# Altium project Mirny.PrjPCB (part 2 of 4)

## Sheet VCO_channel.SchDoc: ADF4351 VCO
size 420 x 297 mm; Author: K.B.; CompanyName: WUT; DrawnBy: K.B.; Organization: WUT ISE; Address1: Warsaw Univeristy of Technology; Address2: Nowowiejska 15/19; DocumentNumber: 3; Revision: 1.1.4; SheetNumber: 2; SheetTotal: 10; EDA_Number: ARTIQ; Projet: ARTIQ/SINARA; ModifiedBy: -; CreateDate: XX/XX/XXXX; CheckedDate: -; Title2: Channel; DivGrp: ISE; Designer: K.B.; ModifiedDate: -; ProjectName: ARTIQ/SINARA
Used 4 times, as channels U_VCO_channel0, U_VCO_channel1, U_VCO_channel2, U_VCO_channel3. Parts and nets are listed once, with the designators drawn on the sheet.
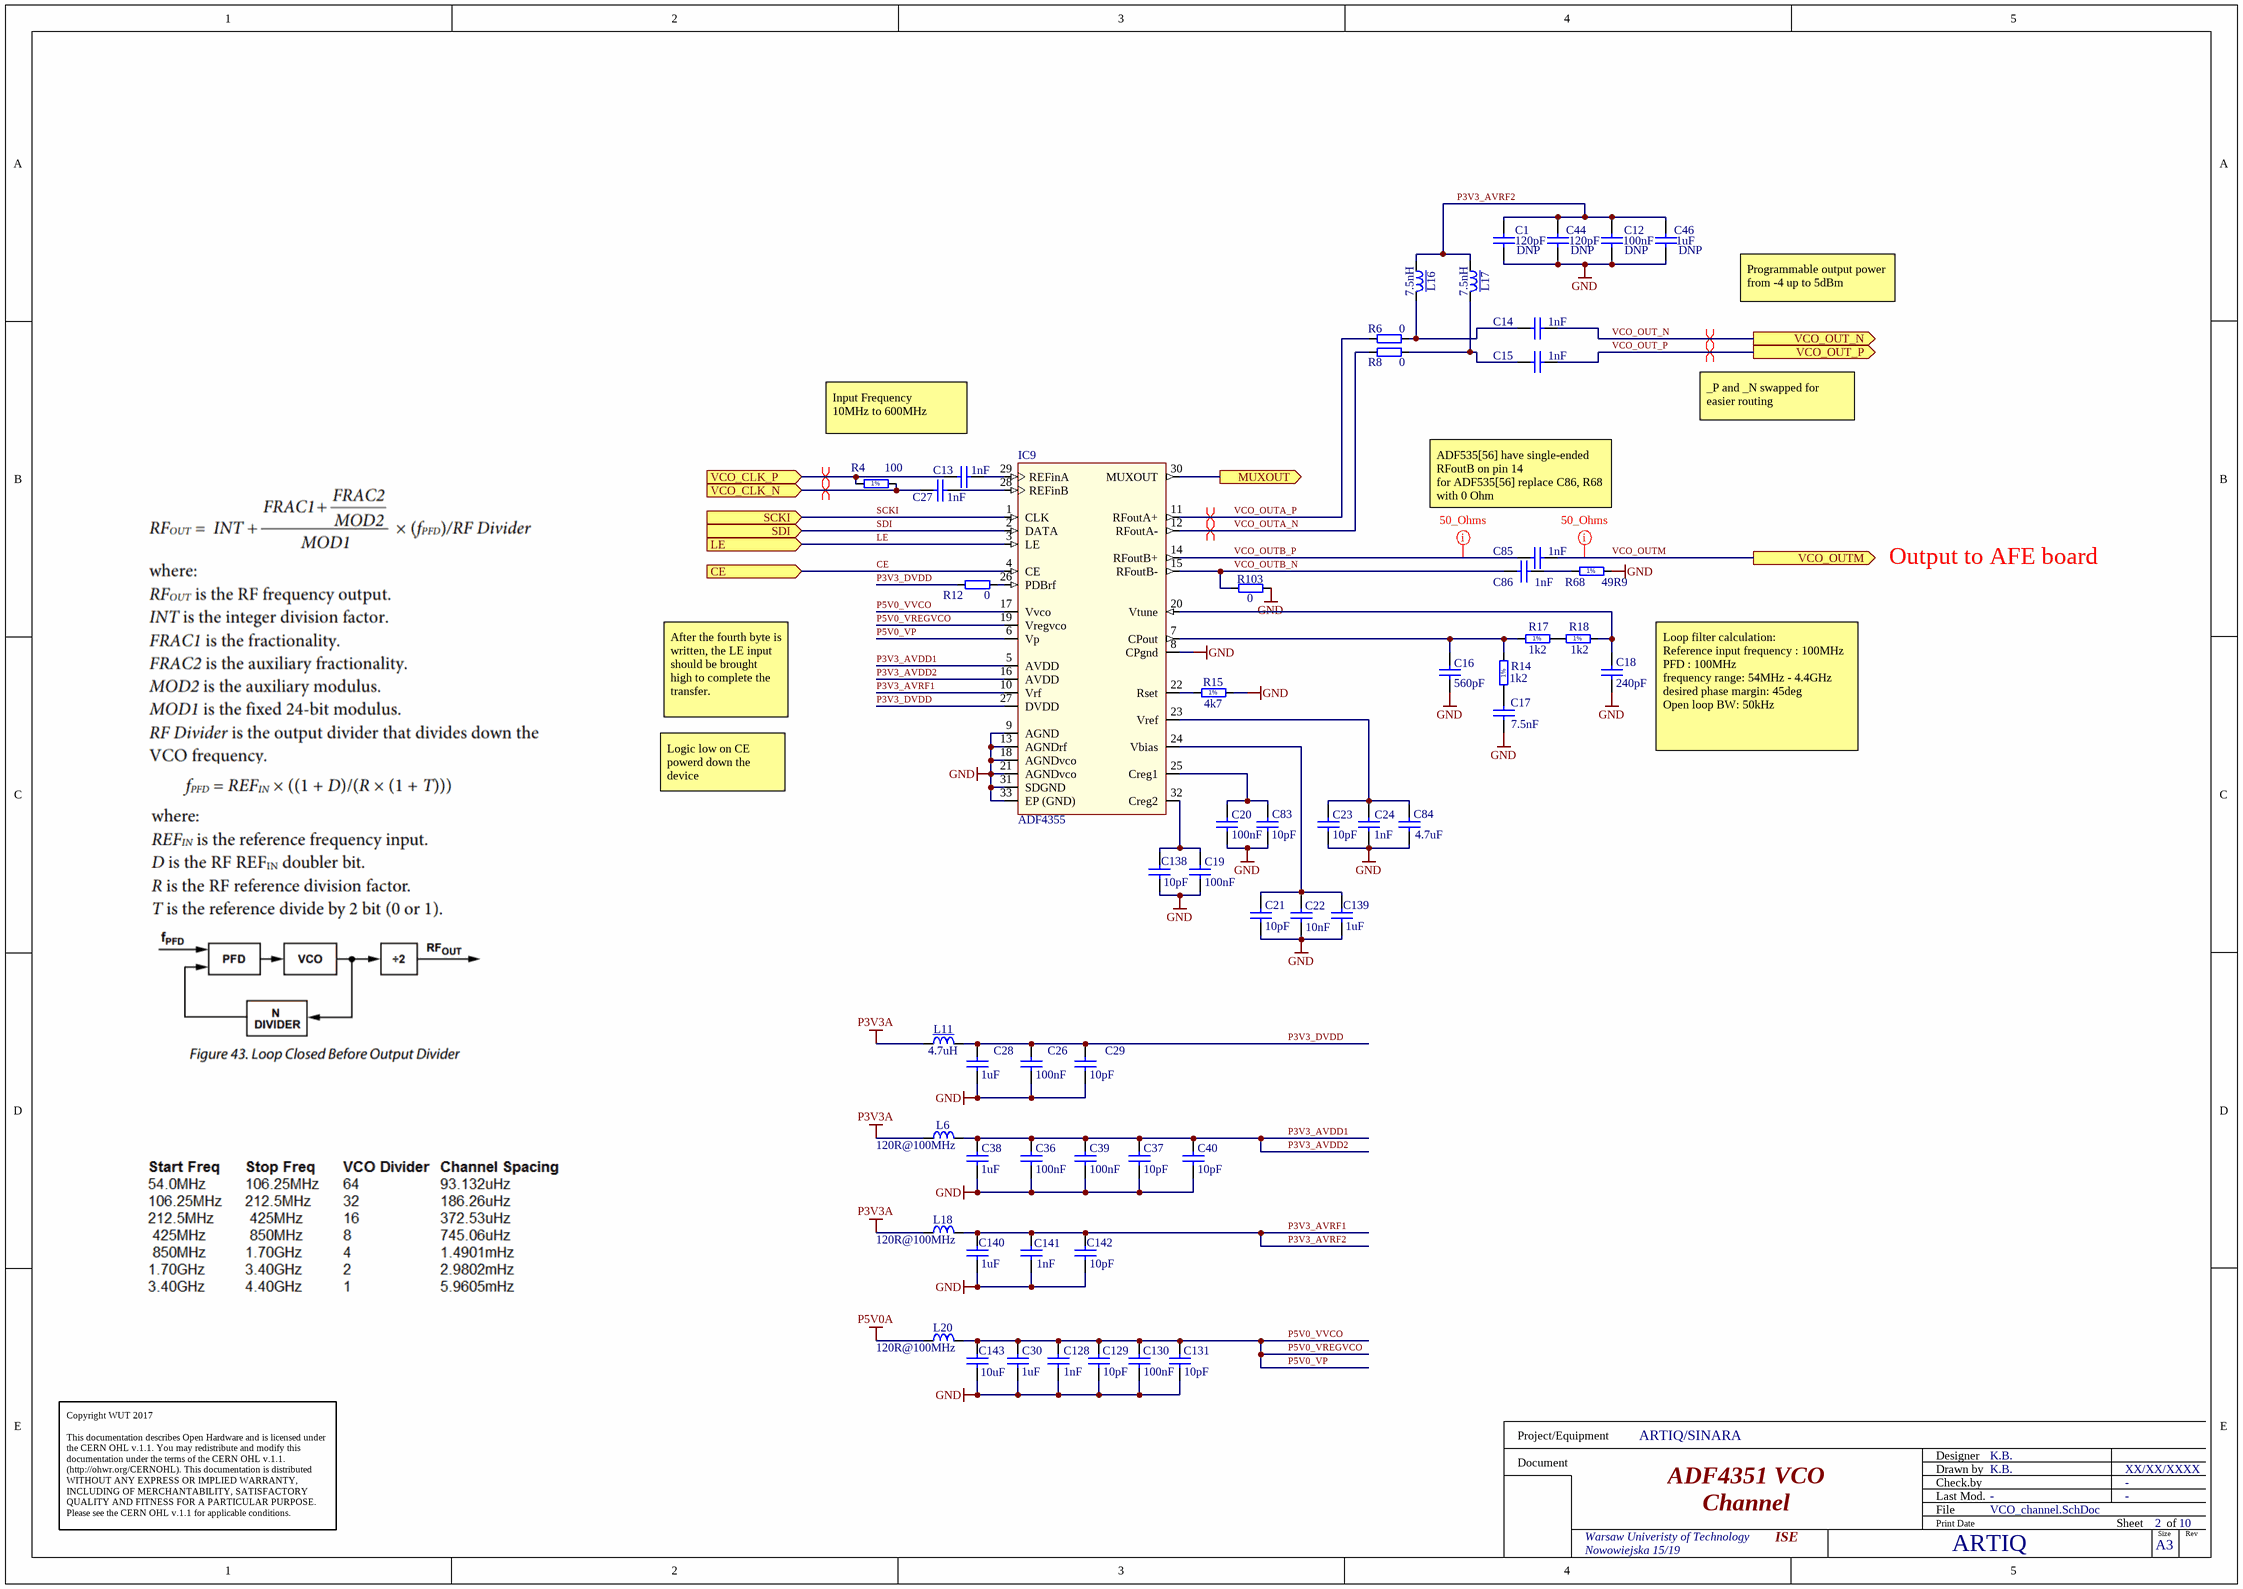
[diagram p3: VCO_channel.SchDoc]

### Parts
C1  120pF  Mounted: DNP  [CAPC1005X55N]
C12  100nF  Mounted: DNP  [CAPC1005X55N]
C13  1nF  [CAPC1005X55N]
C14  1nF  [CAPC1005X55N]
C15  1nF  [CAPC1005X55N]
C16  560pF  [CAPC1005X55N]
C17  7.5nF  [CAPC1005X55N]
C18  240pF  [CAPC1005X55N]
C19  100nF  [CAPC1005X55N]
C20  100nF  [CAPC1005X55N]
C21  10pF  [CAPC1005X55N]
C22  10nF  [CAPC1005X55N]
C23  10pF  [CAPC1005X55N]
C24  1nF  [CAPC1005X55N]
C26  100nF  [CAPC1005X55N]
C27  1nF  [CAPC1005X55N]
C28  1uF  [CAPC1005X55N]
C29  10pF  [CAPC1005X55N]
C30  1uF  [CAPC1005X55N]
C36  100nF  [CAPC1005X55N]
C37  10pF  [CAPC1005X55N]
C38  1uF  [CAPC1005X55N]
C39  100nF  [CAPC1005X55N]
C40  10pF  [CAPC1005X55N]
C44  120pF  Mounted: DNP  [CAPC1005X55N]
C46  1uF  Mounted: DNP  [CAPC1005X55N]
C83  10pF  [CAPC1005X55N]
C84  4.7uF  [CAPC1608X80N]
C85  1nF  [CAPC1005X55N]
C86  1nF  [CAPC1005X55N]
C128  1nF  [CAPC1005X55N]
C129  10pF  [CAPC1005X55N]
C130  100nF  [CAPC1005X55N]
C131  10pF  [CAPC1005X55N]
C138  10pF  [CAPC1005X55N]
C139  1uF  [CAPC1005X55N]
C140  1uF  [CAPC1005X55N]
C141  1nF  [CAPC1005X55N]
C142  10pF  [CAPC1005X55N]
C143  10uF  [CAPC1608X80N]
IC9  ADF4355  [CP-32-7_N]
L6  120R@100MHz  [INDC1608X95N]
L11  4.7uH  [INDC2012X145N]
L16  7.5nH  [IND_COILCRAFT_0402DC]
L17  7.5nH  [IND_COILCRAFT_0402DC]
L18  120R@100MHz  [INDC1608X95N]
L20  120R@100MHz  [INDC1608X95N]
R4  100  [RESC1005X40N]
R6  0  [RESC1005X40N]
R8  0  [RESC1005X40N]
R12  0  [RESC1005X40N]
R14  1k2  [RESC1005X40N]
R15  4k7  [RESC1005X40N]
R17  1k2  [RESC1005X40N]
R18  1k2  [RESC1005X40N]
R68  49R9  [RESC1005X40N]
R103  0  [RESC1005X40N]

### Ports
CE (in), LE (in), MUXOUT (out), SCKI (in), SDI (in), VCO_CLK_N (in), VCO_CLK_P (in), VCO_OUT_N (out), VCO_OUT_P (out), VCO_OUTM (out)

### Nets
GND: C1.1 C12.1 C16.1 C17.1 C18.1 C19.1 C20.1 C21.1 C22.1 C23.1 C24.1 C26.1 C28.1 C29.1 C30.1 C36.1 C37.1 C38.1 C39.1 C40.1 C44.1 C46.1 C83.1 C84.1 C128.1 C129.1 C130.1 C131.1 C138.1 C139.1 C140.1 C141.1 C142.1 C143.1 IC9.8(CPgnd) IC9.9(AGND) IC9.13(AGNDrf) IC9.18(AGNDvco) IC9.21(AGNDvco) IC9.31(SDGND) IC9.33(EP_(GND)) R15.2 R68.2 R103.2
P3V3A: L6.2 L11.1 L18.2
P5V0A: L20.2
CE: IC9.4(CE) ; port CE
LE: IC9.3(LE) ; port LE
MUXOUT: IC9.30(MUXOUT) ; port MUXOUT
P3V3_AVDD1: C36.2 C37.2 C38.2 C39.2 C40.2 IC9.5(AVDD) IC9.16(AVDD) L6.1  [also labelled P3V3_AVDD2]
P3V3_AVRF1: C1.2 C12.2 C44.2 C46.2 C140.2 C141.2 C142.2 IC9.10(Vrf) L16.1 L17.1 L18.1  [also labelled P3V3_AVRF2]
P3V3_DVDD: C26.2 C28.2 C29.2 IC9.27(DVDD) L11.2 R12.1
P5V0_VP: C30.2 C128.2 C129.2 C130.2 C131.2 C143.2 IC9.6(Vp) IC9.17(Vvco) IC9.19(Vregvco) L20.1  [also labelled P5V0_VREGVCO, P5V0_VVCO]
SCKI: IC9.1(CLK) ; port SCKI
SDI: IC9.2(DATA) ; port SDI
VCO_CLK_N: C27.1 R4.2 ; port VCO_CLK_N
VCO_CLK_P: C13.1 R4.1 ; port VCO_CLK_P
VCO_OUT_N: C14.2 ; port VCO_OUT_N
VCO_OUT_P: C15.2 ; port VCO_OUT_P
VCO_OUTA_N: IC9.12(RFoutA-) R8.1
VCO_OUTA_P: IC9.11(RFoutA+) R6.1
VCO_OUTB_N: C86.1 IC9.15(RFoutB-) R103.1
VCO_OUTB_P: C85.1 IC9.14(RFoutB+)
VCO_OUTM: C85.2 ; port VCO_OUTM
NetC13_2: C13.2 IC9.29(REFinA)
NetC14_1: C14.1 L16.2 R6.2
NetC15_1: C15.1 L17.2 R8.2
NetC16_2: C16.2 IC9.7(CPout) R14.2 R17.1
NetC17_2: C17.2 R14.1
NetC18_2: C18.2 IC9.20(Vtune) R18.2
NetC19_2: C19.2 C138.2 IC9.32(Creg2)
NetC20_2: C20.2 C83.2 IC9.25(Creg1)
NetC21_2: C21.2 C22.2 C139.2 IC9.24(Vbias)
NetC23_2: C23.2 C24.2 C84.2 IC9.23(Vref)
NetC27_2: C27.2 IC9.28(REFinB)
NetC86_2: C86.2 R68.1
NetIC9_22: IC9.22(Rset) R15.1
NetIC9_26: IC9.26(PDBrf) R12.2
NetR17_2: R17.2 R18.1

### Channels
U_VCO_channel0: designators end in A; ports CE=CE_U_VCO_channel0 LE=LE_U_VCO_channel0 MUXOUT=VCO_MUXOUT0 SCKI=SCKI_U_VCO_channel0 SDI=SDI_U_VCO_channel0 VCO_CLK_N=VCO_CLK0_N VCO_CLK_P=VCO_CLK0_P VCO_OUT_N=VCO_OUT_N VCO_OUT_P=VCO_OUT_P VCO_OUTM=VCO_OUTM
U_VCO_channel1: designators end in B; ports CE=CE_U_VCO_channel1 LE=LE_U_VCO_channel1 MUXOUT=VCO_MUXOUT1 SCKI=SCKI_U_VCO_channel1 SDI=SDI_U_VCO_channel1 VCO_CLK_N=VCO_CLK1_N VCO_CLK_P=VCO_CLK1_P VCO_OUT_N=VCO_OUT_N VCO_OUT_P=VCO_OUT_P VCO_OUTM=VCO_OUTM
U_VCO_channel2: designators end in C; ports CE=CE_U_VCO_channel2 LE=LE_U_VCO_channel2 MUXOUT=VCO_MUXOUT2 SCKI=SCKI_U_VCO_channel2 SDI=SDI_U_VCO_channel2 VCO_CLK_N=VCO_CLK2_N VCO_CLK_P=VCO_CLK2_P VCO_OUT_N=VCO_OUT_N VCO_OUT_P=VCO_OUT_P VCO_OUTM=VCO_OUTM
U_VCO_channel3: designators end in D; ports CE=CE_U_VCO_channel3 LE=LE_U_VCO_channel3 MUXOUT=VCO_MUXOUT3 SCKI=SCKI_U_VCO_channel3 SDI=SDI_U_VCO_channel3 VCO_CLK_N=VCO_CLK3_N VCO_CLK_P=VCO_CLK3_P VCO_OUT_N=VCO_OUT_N VCO_OUT_P=VCO_OUT_P VCO_OUTM=VCO_OUTM

### Layout directives
differential pair; differential pair class VCO_OUT: VCO_OUT_N, VCO_OUT_P, VCO_OUTA_N_U_VCO_channel0, VCO_OUTA_P_U_VCO_channel0
differential pair: VCO_CLK0_N, VCO_CLK0_P
net class 50_Ohms: VCO_OUTB_P_U_VCO_channel0, VCO_OUTM

### Notes on the sheet
- Programmable output power from -4 up to 5dBm
- Input Frequency
  10MHz to 600MHz
- _P and _N swapped for easier routing
- ADF535[56] have single-ended RFoutB on pin 14
  for ADF535[56] replace C86, R68 with 0 Ohm
- Output to AFE board
- After the fourth byte is written, the LE input should be brought high to complete the transfer.
- Logic low on CE powerd down the device
- Loop filter calculation:
  Reference input frequency : 100MHz
  PFD : 100MHz
  frequency range: 54MHz - 4.4GHz
  desired phase margin: 45deg
  Open loop BW: 50kHz
- Copyright WUT 2017
  This documentation describes Open Hardware and is licensed under the CERN OHL v.1.1. You may redistribute and modify this documentation under the terms of the CERN OHL v.1.1. (http://ohwr.org/CERNOHL). This documentation is distributed WITHOUT ANY EXPRESS OR IMPLIED WARRANTY, INCLUDING OF MERCHANTABILITY, SATISFACTORY QUALITY AND FITNESS FOR A PARTICULAR PURPOSE. Please see the CERN OHL v.1.1 for applicable conditions.
- Project/Equipment
- Document
- Designer
- Drawn by
- Check.by
- File
- Last Mod.
- Print Date
- Sheet
- Size
- A3
- of
- Rev
- (in symbol R0402_4K7_1%_0.0625W_100PPM) 1%
- (in symbol R0402_49R9_1%_0.0625W_100PPM) 1%
- (in symbol R0402_100R_1%_0.0625W_100PPM) 1%

### Library data of the parts
C1 C44 = CC0402_10PF_50V_5%_C0G: Non-polarised capacitor; Part Number: CC0402_120PF_50V_5%_C0G; Part Description: SMD Multilayer Chip Ceramic Capacitor; Manufacturer: GENERIC; Manufacturer1 Part Number: C0402C121J5GACTU; Voltage: 50V; TC: C0G/NP0; Tolerance: ±5%; Component Kind: Standard; Component Type: Standard; Pin Count: 2; Value: 120pF; Status: Preferred; Manufacturer Part Number: CC0402_120PF_50V_5%_C0G; Case: 0402; Socket: No; SMD: Yes; Sense: No; Manufacturer1 Example: KEMET; Manufacturer1 ComponentHeight: 0.55mm; HelpURL: \\cern.ch\dfs\Applications\Altium\Datasheets\CC0805_C0G_KEMET_(Commercial Grade).pdf; Author: CERN DEM JLC; CreateDate: 2007-12-03; LatestRevisionDate: 2015-04-22
C12 C19 C20 C26 C36 C39 C130 = CC0402_100NF_16V_10%_X5R: Non-polarised capacitor; Part Description: SMD Multilayer Chip Ceramic Capacitor; Manufacturer: GENERIC; Manufacturer1 Part Number: GRM155R61C104KA88D; Voltage: 16V; TC: X5R; Tolerance: ±10%; Part Number: CC0402_100NF_16V_10%_X5R; Component Kind: Standard; Component Type: Standard; Pin Count: 2; Value: 100nF; Status: None; Manufacturer Part Number: CC0402_100NF_16V_10%_X5R; Case: 0402; Socket: No; SMD: Yes; Sense: No; Manufacturer1 Example: MURATA; Manufacturer1 ComponentHeight: 0.55mm; HelpURL: \\cern.ch\dfs\Applications\Altium\Datasheets\CC0402_X5R_MURATA_GRM.pdf; Author: CERN DEM JLC; CreateDate: 10.12.2013; LatestRevisionDate: 10.12.2013
  C19 C20 C26 C36 C39 C130: Mounted: Yes
C13-C15 C24 C27 C85 C86 C128 C141 = CC0402_1NF_50V_10%_X7R: Non-polarised capacitor; Part Description: SMD Multilayer Chip Ceramic Capacitor; Manufacturer: GENERIC; Manufacturer1 Part Number: 223858715623; Voltage: 50V; TC: X7R; Tolerance: ±10%; Part Number: CC0402_1NF_50V_10%_X7R; Component Kind: Standard; Component Type: Standard; Pin Count: 2; Value: 1nF; Status: Not Recommended; Manufacturer Part Number: CC0402_1NF_50V_10%_X7R; Case: 0402; Mounted: Yes; Socket: No; SMD: Yes; Sense: No; Manufacturer1 Example: PHYCOMP; Manufacturer1 ComponentHeight: 0.55mm; HelpURL: \\cern.ch\dfs\Applications\Altium\Datasheets\CC0402_X7R_PHYCOMP.pdf; Author: CERN DEM JLC; CreateDate: 03.12.2007; LatestRevisionDate: 03.12.2007
C16 = CC0402_10PF_50V_5%_C0G: Non-polarised capacitor; Part Number: CC0402_560PF_50V_5%_C0G; Part Description: SMD Multilayer Chip Ceramic Capacitor; Manufacturer: GENERIC; Manufacturer1 Part Number: GCM1555C1H561JA16D; Voltage: 50V; TC: C0G/NP0; Tolerance: ±5%; Component Kind: Standard; Component Type: Standard; Pin Count: 2; Value: 560pF; Status: Preferred; Manufacturer Part Number: CC0402_560PF_50V_5%_C0G; Case: 0402; Mounted: Yes; Socket: No; SMD: Yes; Sense: No; Manufacturer1 Example: Murata; Manufacturer1 ComponentHeight: 0.55mm; HelpURL: \\cern.ch\dfs\Applications\Altium\Datasheets\CC0805_C0G_KEMET_(Commercial Grade).pdf; Author: CERN DEM JLC; CreateDate: 2007-12-03; LatestRevisionDate: 2015-04-22
C17 = CC0402_10PF_50V_5%_C0G: Non-polarised capacitor; Part Number: CC0402_7N5F_25V_5%_X7R; Part Description: SMD Multilayer Chip Ceramic Capacitor; Manufacturer: GENERIC; Manufacturer1 Part Number: GRM155R71E752JA01D; Voltage: 25V; TC: X7R; Tolerance: ±5%; Component Kind: Standard; Component Type: Standard; Pin Count: 2; Value: 7.5nF; Status: Preferred; Manufacturer Part Number: CC0402_7N5F_25V_5%_X7R; Case: 0402; Mounted: Yes; Socket: No; SMD: Yes; Sense: No; Manufacturer1 Example: MURATA; Manufacturer1 ComponentHeight: 0.55mm; HelpURL: \\cern.ch\dfs\Applications\Altium\Datasheets\CC0805_C0G_KEMET_(Commercial Grade).pdf; Author: CERN DEM JLC; CreateDate: 2007-12-03; LatestRevisionDate: 2015-04-22
C18 = CC0402_10PF_50V_5%_C0G: Non-polarised capacitor; Part Number: CC0402_240PF_50V_5%_C0G; Part Description: SMD Multilayer Chip Ceramic Capacitor; Manufacturer: GENERIC; Manufacturer1 Part Number: GRM1555C1H241JA01D; Voltage: 50V; TC: C0G/NP0; Tolerance: ±5%; Component Kind: Standard; Component Type: Standard; Pin Count: 2; Value: 240pF; Status: Preferred; Manufacturer Part Number: CC0402_240PF_50V_5%_C0G; Case: 0402; Mounted: Yes; Socket: No; SMD: Yes; Sense: No; Manufacturer1 Example: MURATA; Manufacturer1 ComponentHeight: 0.55mm; HelpURL: \\cern.ch\dfs\Applications\Altium\Datasheets\CC0805_C0G_KEMET_(Commercial Grade).pdf; Author: CERN DEM JLC; CreateDate: 2007-12-03; LatestRevisionDate: 2015-04-22
C21 C23 C29 C37 C40 C83 C129 C131 C138 C142 = CC0402_10PF_50V_5%_C0G: Non-polarised capacitor; Part Description: SMD Multilayer Chip Ceramic Capacitor; Manufacturer: GENERIC; Manufacturer1 Part Number: C0402C100J5GACTU; Voltage: 50V; TC: C0G/NP0; Tolerance: ±5%; Part Number: CC0402_10PF_50V_5%_C0G; Component Kind: Standard; Component Type: Standard; Pin Count: 2; Value: 10pF; Status: Preferred; Manufacturer Part Number: CC0402_10PF_50V_5%_C0G; Case: 0402; Mounted: Yes; Socket: No; SMD: Yes; Sense: No; Manufacturer1 Example: KEMET; Manufacturer1 ComponentHeight: 0.55mm; HelpURL: \\cern.ch\dfs\Applications\Altium\Datasheets\CC0805_C0G_KEMET_(Commercial Grade).pdf; Author: CERN DEM JLC; CreateDate: 2007-12-03; LatestRevisionDate: 2015-04-22
C22 = CC0402_10NF_16V_10%_X7R: Non-polarised capacitor; Part Description: SMD Multilayer Chip Ceramic Capacitor; Manufacturer: GENERIC; Manufacturer1 Part Number: 223878715636; Voltage: 16V; TC: X7R; Tolerance: ±10%; Part Number: CC0402_10NF_16V_10%_X7R; Component Kind: Standard; Component Type: Standard; Pin Count: 2; Value: 10nF; Status: Not Recommended; Manufacturer Part Number: CC0402_10NF_16V_10%_X7R; Case: 0402; Mounted: Yes; Socket: No; SMD: Yes; Sense: No; Manufacturer1 Example: PHYCOMP; Manufacturer1 ComponentHeight: 0.55mm; HelpURL: \\cern.ch\dfs\Applications\Altium\Datasheets\CC0402_X7R_PHYCOMP.pdf; Author: CERN DEM JLC; CreateDate: 03.12.2007; LatestRevisionDate: 03.12.2007
C28 C30 C38 C46 C139 C140 = CC0402_1UF_16V_10%_X5R: Non-polarised capacitor; Part Description: SMD Multilayer Chip Ceramic Capacitor; Manufacturer: GENERIC; Manufacturer1 Part Number: C1005X5R1C105KT; Voltage: 16V; TC: X5R; Tolerance: ±10%; Part Number: CC0402_1UF_16V_10%_X5R; Component Kind: Standard; Component Type: Standard; Pin Count: 2; Value: 1uF; Status: Preferred; Manufacturer Part Number: CC0402_1UF_16V_10%_X5R; Case: 0402; Socket: No; SMD: Yes; Sense: No; Manufacturer1 Example: TDK; Manufacturer1 ComponentHeight: 0.55mm; HelpURL: \\cern.ch\dfs\Applications\Altium\Datasheets\CC0402_X5R_TDK_C.pdf; Author: CERN DEM JLC; CreateDate: 2012-10-25; LatestRevisionDate: 2012-10-25
  C28 C30 C38 C139 C140: Mounted: Yes
C84 = CC0603_10UF_16V_20%_X5R: Non-polarised capacitor; Part Number: CC0603_4U7F_16V_10%_X5R; Part Description: SMD Multilayer Chip Ceramic Capacitor; Manufacturer: GENERIC; Manufacturer1 Part Number: C1608X5R1C475K080AC; Voltage: 16V; TC: X5R; Tolerance: ±10%; Component Kind: Standard; Component Type: Standard; Pin Count: 2; Value: 4.7uF; Status: None; Manufacturer Part Number: CC0603_4U7F_16V_10%_X5R; Case: 0603; Mounted: Yes; Socket: No; SMD: Yes; Sense: No; Manufacturer1 Example: TDK; Manufacturer1 ComponentHeight: 0.8mm; HelpURL: \\cern.ch\dfs\Applications\Altium\Datasheets\CC0603_X5R_MURATA_GRM.pdf; Author: CERN DEM MR; CreateDate: 2016-03-02; LatestRevisionDate: 2016-03-02
C143 = CC0603_10UF_16V_20%_X5R: Non-polarised capacitor; Part Description: SMD Multilayer Chip Ceramic Capacitor; Manufacturer: GENERIC; Manufacturer1 Part Number: GRM188R61C106MA73D; Voltage: 16V; TC: X5R; Tolerance: ±20%; Part Number: CC0603_10UF_16V_20%_X5R; Component Kind: Standard; Component Type: Standard; Pin Count: 2; Value: 10uF; Status: None; Manufacturer Part Number: CC0603_10UF_16V_20%_X5R; Case: 0603; Mounted: Yes; Socket: No; SMD: Yes; Sense: No; Manufacturer1 Example: MURATA; Manufacturer1 ComponentHeight: 0.8mm; HelpURL: \\cern.ch\dfs\Applications\Altium\Datasheets\CC0603_X5R_MURATA_GRM.pdf; Author: CERN DEM MR; CreateDate: 2016-03-02; LatestRevisionDate: 2016-03-02
IC9 = ADF4355: 54MHz to 4400MHz Frequency Synthesizer; Manufacturer: Analog Devices; Manufacturer Part Number: ADF4355-2BCPZ; Bonding: No; PressFit: No; CreateDate: 2018-06-18; Component Type: Standard; LatestRevisionDate: 2018-06-18; Component Kind: Standard; ComponentHeight: 0.75mm; Footprint: LFCSP-32 (CP-32-7); PackageDescription: 32-Lead LFCSP (CP-32-7); ComponentLink1Description: Manufacturer Link; ComponentLink1URL: http://www.analog.com/en/prod/0%2C2877%2CAD809%2C00.html; ComponentLink2Description: Datasheet; ComponentLink2URL: http://www.analog.com/UploadedFiles/Data_Sheets/653287459AD809_a.pdf; Mounted: Yes; Part Description: 54MHz to 4400MHz Frequency Synthesizer; Part Number: ADF4355-2BCPZ; Pin Count: 32; Sense: No; SMD: Yes; Socket: No
L6 L18 L20 = IND0603_MURATA_BLM18PG121SN1D: Inductor; Part Description: SMD EMIFIL Chip Ferrite Bead; Manufacturer: MURATA; Power: 2A; Resistance: 0.05R; Part Number: IND0603_MURATA_BLM18PG121SN1D; Component Kind: Standard; Component Type: Standard; Pin Count: 2; Value: 120R@100MHz; Status: None; Manufacturer Part Number: BLM18PG121SN1D; Case: 0603; Mounted: Yes; Socket: No; SMD: Yes; Sense: No; ComponentHeight: 0.95mm; HelpURL: \\cern.ch\dfs\Applications\Altium\Datasheets\IND0603_MURATA_BLM18P.pdf; Author: CERN DEM BC; CreateDate: 2015-07-27; LatestRevisionDate: 2015-07-27
L11 = IND0805_4.7UH_20%_KEMET_L-DWI: Inductor With Core; Part Description: Wire Wound Chip Inductors; Manufacturer: KEMET; Manufacturer Part Number: L0805C4R7MDWIT; Power: 360mA; Resistance: 0.5R; Tolerance: ±20%; Part Number: IND0805_4.7UH_20%_KEMET_L-DWI; Component Kind: Standard; Component Type: Standard; Pin Count: 2; Value: 4.7uH; Status: None; Case: 0805; Mounted: Yes; Socket: No; SMD: Yes; Sense: No; ComponentHeight: 1.45mm; HelpURL: \\cern.ch\dfs\Applications\Altium\Datasheets\IND0805_KEMET_L-DWI .pdf; Author: CERN DEM JLC; CreateDate: 26.01.2010; LatestRevisionDate: 26.01.2010
L16 L17 = IND0402_7.5NH_2%_COILCRAFT_0402DC: Inductor With Core; Part Description: Ceramic Wirewound Chip Inductor, 0402DC Series; Manufacturer Part Number: 0402DC-7N5XGRW; Power: 1.65A; Resistance: 0.063R; Tolerance: ±2%; Part Number: IND0402_7.5NH_2%_COILCRAFT_0402DC; Component Kind: Standard; Component Type: Standard; Pin Count: 2; Value: 7.5nH; Status: None; Manufacturer: COILCRAFT; Case: 0402; Mounted: Yes; Socket: No; SMD: Yes; Sense: No; ComponentHeight: 0.61mm; HelpURL: \\cern.ch\dfs\Applications\Altium\Datasheets\IND0402_COILCRAFT_0402DC.pdf; Author: GK; CreateDate: 04.12.2018; LatestRevisionDate: 04.12.2018
R4 = R0402_100R_1%_0.0625W_100PPM: Resistor - 1%; Part Description: General Purpose Thick Film Chip Resistor; Manufacturer: GENERIC; Manufacturer1 Part Number: 232270671001L; TC: ±100ppm/°C; PressFit: No; Part Number: R0402_100R_1%_0.0625W_100PPM; Component Kind: Standard; Component Type: Standard; Pin Count: 2; Value: 100; Status: Not Recommended; Power: 0.0625W; Tolerance: ±1%; Manufacturer Part Number: R0402_100R_1%_0.0625W_100PPM; Case: 0402; Mounted: Yes; Sense: No; Socket: No; SMD: Yes; Manufacturer1 Example: YAGEO PHYCOMP; Manufacturer1 ComponentHeight: 0.4mm; HelpURL: \\cern.ch\dfs\Applications\Altium\Datasheets\R0402_Phycomp_RC0402.pdf; Author: CERN DEM JLC; CreateDate: 03.12.2007; LatestRevisionDate: 17.10.2012
R6 R8 R12 R103 = R0402_0R_JUMPER: Resistor; Part Description: 1A (0.05R Max DC Resistance) Zero Ohm Jumper; Manufacturer: GENERIC; Manufacturer1 Part Number: 232270591001L; PressFit: No; Part Number: R0402_0R_JUMPER; Component Kind: Standard; Component Type: Standard; Pin Count: 2; Value: 0; Status: Not Recommended; Manufacturer Part Number: R0402_0R_JUMPER; Case: 0402; Mounted: Yes; Sense: No; Socket: No; SMD: Yes; Manufacturer1 Example: YAGEO PHYCOMP; Manufacturer1 ComponentHeight: 0.4mm; HelpURL: \\cern.ch\dfs\Applications\Altium\Datasheets\R0402_Phycomp_RC0402.pdf; Author: CERN DEM JLC; CreateDate: 03.12.2007; LatestRevisionDate: 17.10.2012
R14 R17 R18 = R0402_49R9_1%_0.0625W_100PPM: Resistor - 1%; Part Number: R0402_1K2_1%_0.0625W_100PPM; Part Description: General Purpose Thick Film Chip Resistor; Manufacturer: GENERIC; Manufacturer1 Part Number: NRC04F1201TRF; TC: ±100ppm/°C; PressFit: No; Component Kind: Standard; Component Type: Standard; Pin Count: 2; Value: 1k2; Status: Preferred; Power: 0.0625W; Tolerance: ±1%; Manufacturer Part Number: R0402_1K2_1%_0.0625W_100PPM; Case: 0402; Mounted: Yes; Sense: No; Socket: No; SMD: Yes; Manufacturer1 Example: NIC COMPONENT; Manufacturer1 ComponentHeight: 0.4mm; HelpURL: \\cern.ch\dfs\Applications\Altium\Datasheets\R0402_Phycomp_RC0402.pdf; Author: CERN DEM JLC; CreateDate: 24.10.2012; LatestRevisionDate: 24.10.2012
R15 = R0402_4K7_1%_0.0625W_100PPM: Resistor - 1%; Part Description: General Purpose Thick Film Chip Resistor; Manufacturer: GENERIC; Manufacturer1 Part Number: 232270674702L; TC: ±100ppm/°C; Part Number: R0402_4K7_1%_0.0625W_100PPM; Component Kind: Standard; Component Type: Standard; Pin Count: 2; Value: 4k7; Status: Not recommended; Power: 0.0625W; Tolerance: ±1%; Manufacturer Part Number: R0402_4K7_1%_0.0625W_100PPM; Case: 0402; Mounted: Yes; Sense: No; Socket: No; SMD: Yes; Manufacturer1 Example: YAGEO PHYCOMP; Manufacturer1 ComponentHeight: 0.4mm; HelpURL: \\cern.ch\dfs\Applications\Altium\Datasheets\R0402_Phycomp_RC0402.pdf; Author: CERN DEM JLC; CreateDate: 2007-12-03; LatestRevisionDate: 2012-10-17
R68 = R0402_49R9_1%_0.0625W_100PPM: Resistor - 1%; Part Description: General Purpose Thick Film Chip Resistor; Manufacturer: GENERIC; Manufacturer1 Part Number: 232270674999L or RC0402FR-0749R9L; TC: ±100ppm/°C; PressFit: No; Part Number: R0402_49R9_1%_0.0625W_100PPM; Component Kind: Standard; Component Type: Standard; Pin Count: 2; Value: 49R9; Status: Not Recommended; Power: 0.0625W; Tolerance: ±1%; Manufacturer Part Number: R0402_49R9_1%_0.0625W_100PPM; Case: 0402; Mounted: Yes; Sense: No; Socket: No; SMD: Yes; Manufacturer1 Example: YAGEO PHYCOMP; Manufacturer1 ComponentHeight: 0.4mm; HelpURL: \\cern.ch\dfs\Applications\Altium\Datasheets\R0402_Phycomp_RC0402.pdf; Author: CERN DEM JLC; CreateDate: 24.10.2012; LatestRevisionDate: 24.10.2012

## Sheet VCO_OUT_channel.SchDoc: Output stage :
size 420 x 297 mm; Author: K.B.; CompanyName: WUT; DrawnBy: K.B.; Organization: WUT ISE; Address1: Warsaw Univeristy of Technology; Address2: Nowowiejska 15/19; DocumentNumber: 4; Revision: 1.1.4; SheetNumber: 4; SheetTotal: 12; EDA_Number: ARTIQ; Projet: ARTIQ/SINARA; ModifiedBy: -; CreateDate: XX/XX/XXXX; CheckedDate: -; Title2: Attenuator, amplifier and filter; DivGrp: ISE; Designer: K.B.; ModifiedDate: -; ProjectName: ARTIQ/SINARA
Used 4 times, as channels U_VCO_OUT_channel0, U_VCO_OUT_channel1, U_VCO_OUT_channel2, U_VCO_OUT_channel3. Parts and nets are listed once, with the designators drawn on the sheet.
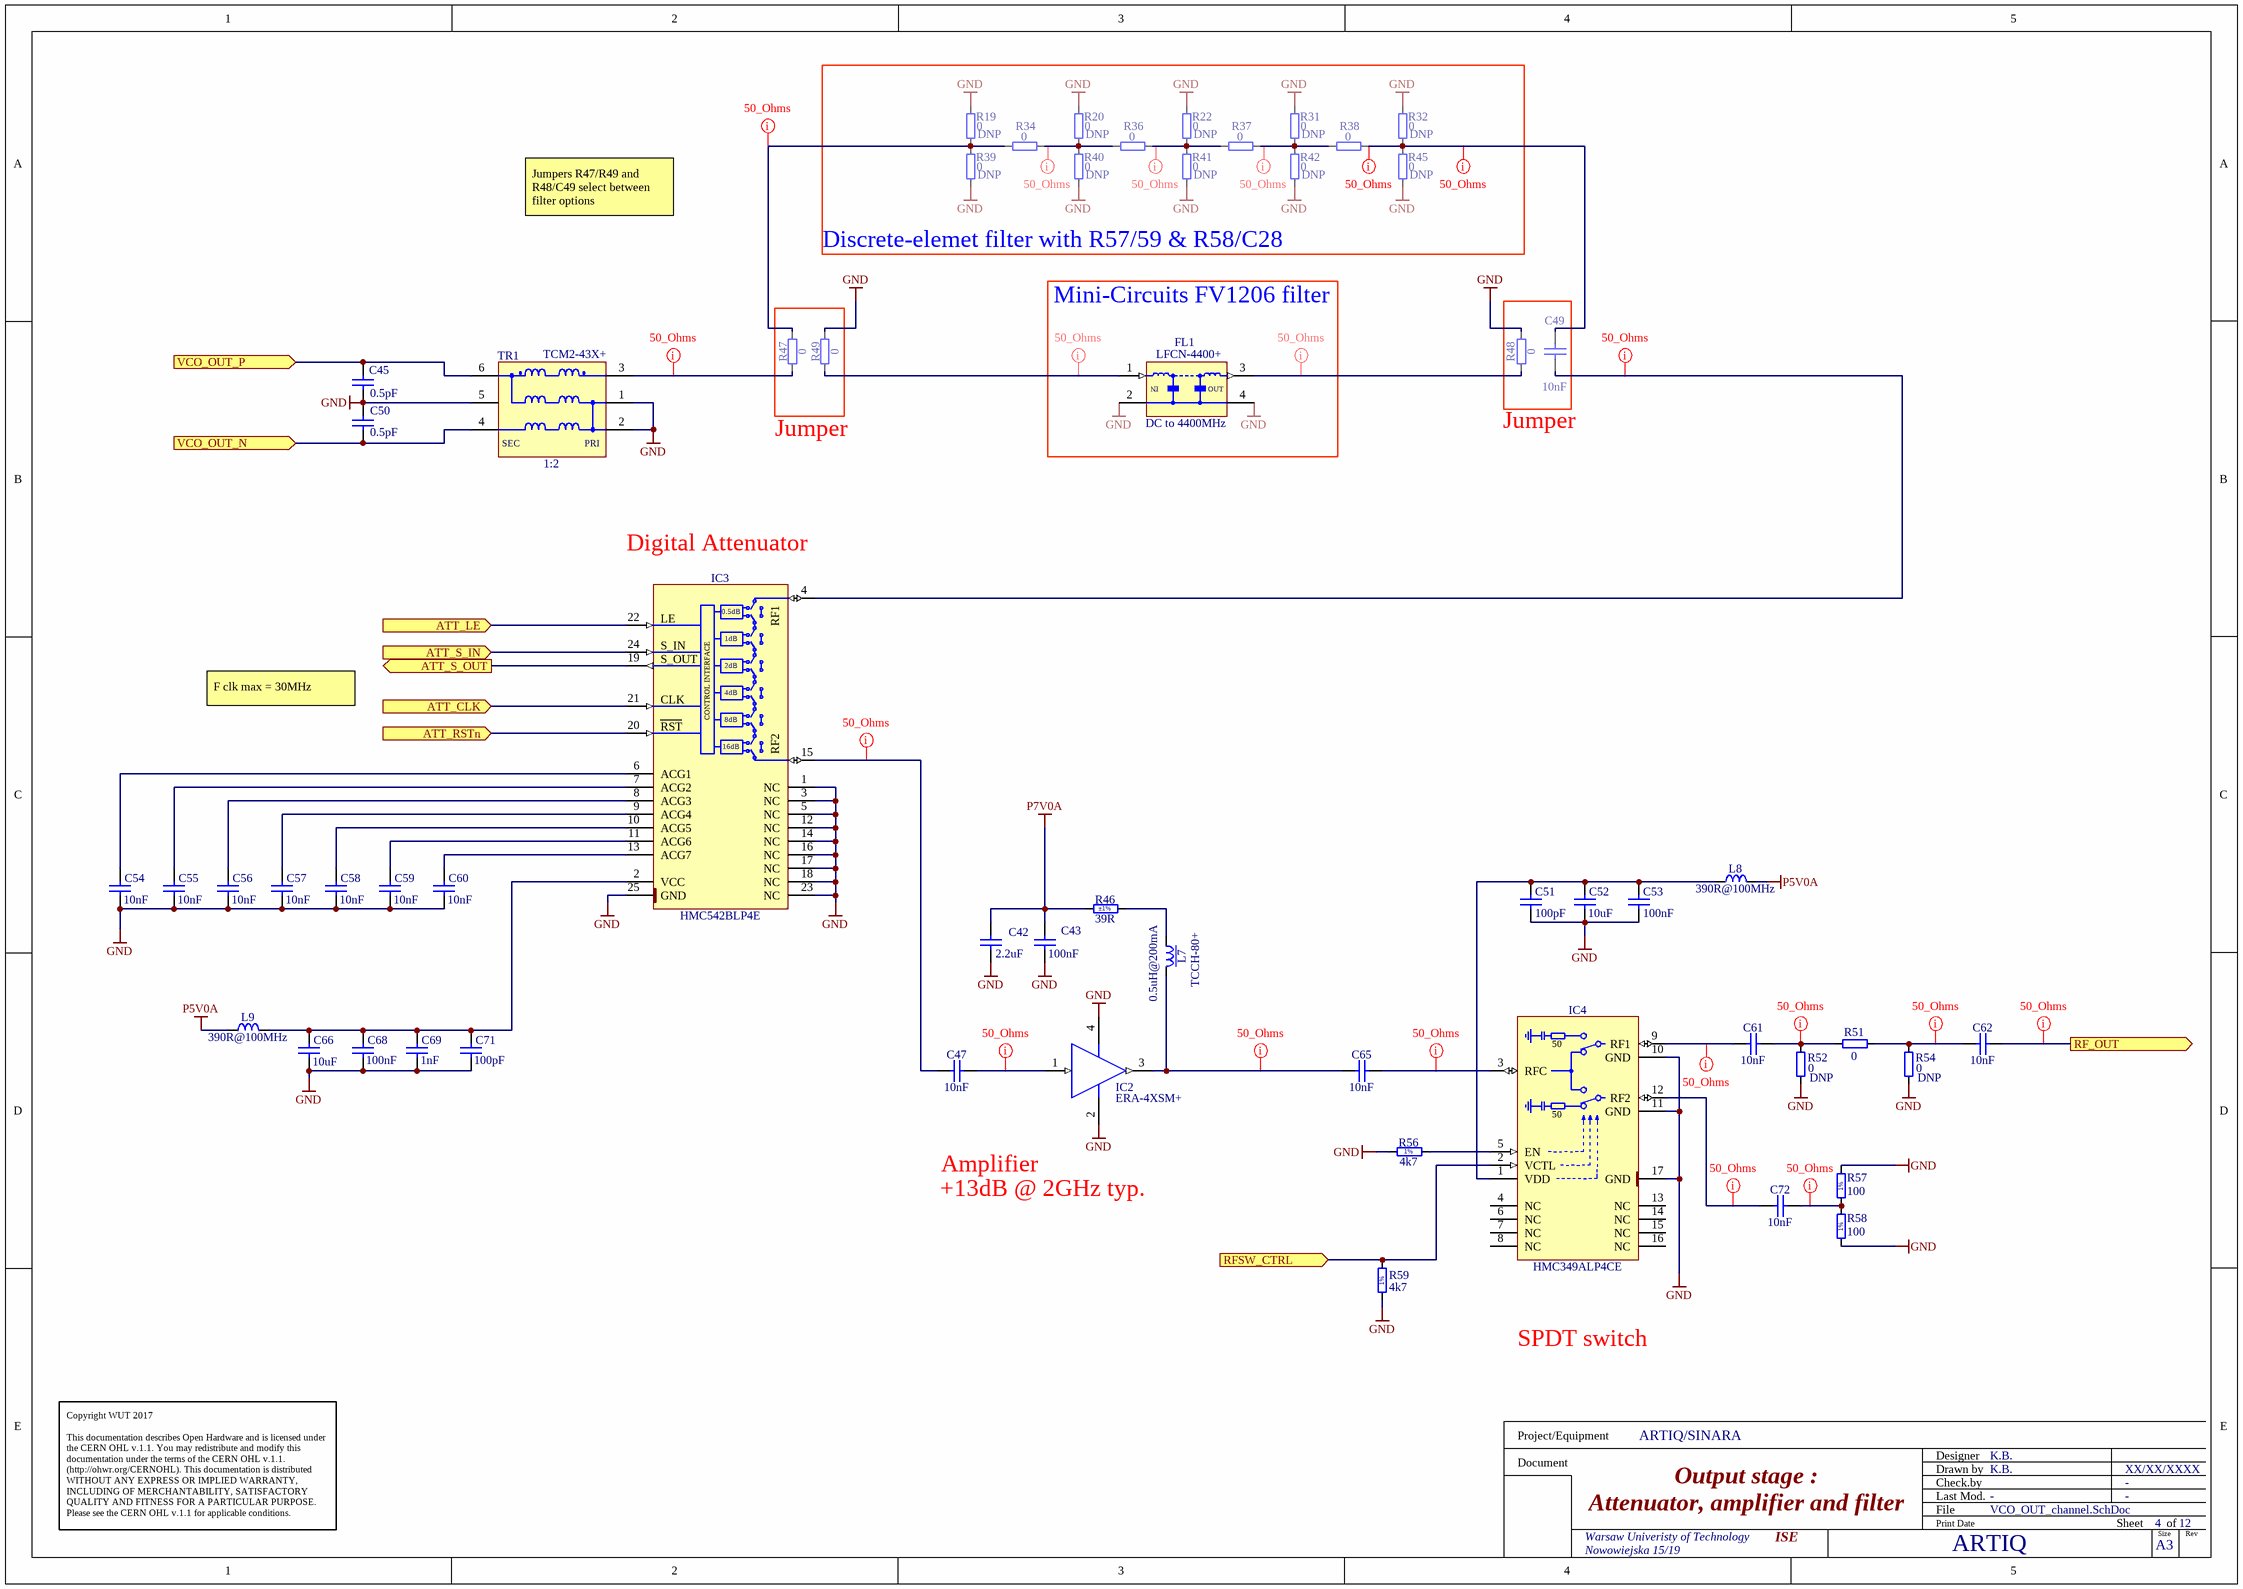
[diagram p4: VCO_OUT_channel.SchDoc]

### Parts
C42  2.2uF  [CAPC2012X140N]
C43  100nF  [CAPC1005X55N]
C45  0.5pF  [CAPC0402(1005)60_M]
C47  10nF  [CAPC1005X55N]
C49  10nF  [CAPC1005X55N]
C50  0.5pF  [CAPC0402(1005)60_M]
C51  100pF  [CAPC1005X55N]
C52  10uF  [CAPC1608X80N]
C53  100nF  [CAPC1005X55N]
C54  10nF  [CAPC1005X55N]
C55  10nF  [CAPC1005X55N]
C56  10nF  [CAPC1005X55N]
C57  10nF  [CAPC1005X55N]
C58  10nF  [CAPC1005X55N]
C59  10nF  [CAPC1005X55N]
C60  10nF  [CAPC1005X55N]
C61  10nF  [CAPC1005X55N]
C62  10nF  [CAPC1005X55N]
C65  10nF  [CAPC1005X55N]
C66  10uF  [CAPC1608X80N]
C68  100nF  [CAPC1005X55N]
C69  1nF  [CAPC1005X55N]
C71  100pF  [CAPC1005X55N]
C72  10nF  [CAPC1005X55N]
FL1  DC to 4400MHz  Manufacturer Part Number: LFCN-4400+  [FIL_MINI-CIRCUITS_FV1206]
IC2  ERA-4XSM+  [MINI-CIRCUITS_WW107]
IC3  HMC542BLP4E  [QFN50P400X400X100-25N-S295]
IC4  HMC349ALP4CE  [QFN65P400X400X100-17N-S255]
L7  0.5uH@200mA  Manufacturer Part Number: TCCH-80+  [IND_MINI-CIRCUITS_GU1604]
L8  390R@100MHz  [INDC1608X95N]
L9  390R@100MHz  [INDC1608X95N]
R19  0  Mounted: DNP  [RESC1005X40N]
R20  0  Mounted: DNP  [RESC1005X40N]
R22  0  Mounted: DNP  [RESC1005X40N]
R31  0  Mounted: DNP  [RESC1005X40N]
R32  0  Mounted: DNP  [RESC1005X40N]
R34  0  [RESC1005X40N]
R36  0  [RESC1005X40N]
R37  0  [RESC1005X40N]
R38  0  [RESC1005X40N]
R39  0  Mounted: DNP  [RESC1005X40N]
R40  0  Mounted: DNP  [RESC1005X40N]
R41  0  Mounted: DNP  [RESC1005X40N]
R42  0  Mounted: DNP  [RESC1005X40N]
R45  0  Mounted: DNP  [RESC1005X40N]
R46  39R  Tolerance: ±1%  [RESC3225X70N]
R47  0  [RESC1005X40N]
R48  0  [RESC1005X40N]
R49  0  [RESC1005X40N]
R51  0  [RESC1005X40N]
R52  0  Mounted: DNP  [RESC1005X40N]
R54  0  Mounted: DNP  [RESC1005X40N]
R56  4k7  [RESC1005X40N]
R57  100  [RESC1005X40N]
R58  100  [RESC1005X40N]
R59  4k7  [RESC1005X40N]
TR1  1:2  Manufacturer Part Number: TCM2-43X+  [XFMR_MINI-CIRCUITS_DB1627]

### Blocks framed on the sheet
Discrete-elemet filter with R57/59 & R58/C28: R19 R20 R22 R31 R32 R34 R36-R42 R45
Mini-Circuits FV1206 filter: FL1

### Ports
ATT_CLK (in), ATT_LE (in), ATT_RSTn (in), ATT_S_IN (in), ATT_S_OUT (out), RF_OUT (out), RFSW_CTRL (in), VCO_OUT_N (in), VCO_OUT_P (in)

### Nets
GND: C42.1 C43.1 C45.1 C50.2 C51.2 C52.1 C53.1 C54.1 C55.1 C56.1 C57.1 C58.1 C59.1 C60.1 C66.1 C68.1 C69.1 C71.1 FL1.2(GND) FL1.4(GND) IC2.2(GND) IC2.4(GND) IC3.1(NC) IC3.3(NC) IC3.5(NC) IC3.12(NC) IC3.14(NC) IC3.16(NC) IC3.17(NC) IC3.18(NC) IC3.23(NC) IC3.25(GND) IC4.10(GND) IC4.11(GND) IC4.17(GND) R19.1 R20.1 R22.1 R31.1 R32.1 R39.1 R40.1 R41.1 R42.1 R45.1 R48.1 R49.2 R52.1 R54.1 R56.1 R57.2 R58.1 R59.1 TR1.1(P1) TR1.2(P1) TR1.5(NC)
P5V0A: L8.2 L9.1
P7V0A: C42.2 C43.2 R46.1
ATT_CLK: IC3.21(SHIFT_CLOCK) ; port ATT_CLK
ATT_LE: IC3.22(LATCH_ENABLE) ; port ATT_LE
ATT_RSTn: IC3.20(~{RESET}) ; port ATT_RSTn
ATT_S_IN: IC3.24(SERIAL_INPUT) ; port ATT_S_IN
ATT_S_OUT: IC3.19(SERIAL_OUTPUT) ; port ATT_S_OUT
RF_OUT: C62.2 ; port RF_OUT
RFSW_CTRL: IC4.2(VCTL) R59.2 ; port RFSW_CTRL
VCO_OUT_N: C50.1 TR1.4(S1) ; port VCO_OUT_N
VCO_OUT_P: C45.2 TR1.6(S1) ; port VCO_OUT_P
NetC47_1: C47.1 IC3.15(RF2)
NetC47_2: C47.2 IC2.1(RF_IN)
NetC49_1: C49.1 IC3.4(RF1)
NetC49_2: C49.2 R32.2 R38.1 R45.2
NetC51_1: C51.1 C52.2 C53.2 IC4.1(VDD) L8.1
NetC54_2: C54.2 IC3.6(ACG1)
NetC55_2: C55.2 IC3.7(ACG2)
NetC56_2: C56.2 IC3.8(ACG3)
NetC57_2: C57.2 IC3.9(ACG4)
NetC58_2: C58.2 IC3.10(ACG5)
NetC59_2: C59.2 IC3.11(ACG6)
NetC60_2: C60.2 IC3.13(ACG7)
NetC61_1: C61.1 IC4.9(RF1)
NetC61_2: C61.2 R51.1 R52.2
NetC62_1: C62.1 R51.2 R54.2
NetC65_1: C65.1 IC2.3(RF_OUT) L7.3
NetC65_2: C65.2 IC4.3(RFC)
NetC66_2: C66.2 C68.2 C69.2 C71.2 IC3.2(VCC) L9.2
NetC72_1: C72.1 IC4.12(RF2)
NetC72_2: C72.2 R57.1 R58.2
NetFL1_1: FL1.1(RFIN) R49.1
NetFL1_3: FL1.3(RFOUT) R48.2
NetIC4_5: IC4.5(EN) R56.2
NetL7_1: L7.1 R46.2
NetR19_2: R19.2 R34.1 R39.2 R47.2
NetR20_2: R20.2 R34.2 R36.1 R40.2
NetR22_2: R22.2 R36.2 R37.1 R41.2
NetR31_2: R31.2 R37.2 R38.2 R42.2
NetR47_1: R47.1 TR1.3(P1)

Not connected (* = marked no-connect by the designer): IC4 4(NC) 6(NC) 7(NC) 8(NC) 13(NC) 14(NC) 15(NC) 16(NC)

### Channels
U_VCO_OUT_channel0: designators end in A; ports ATT_CLK=ATT_CLK_0 ATT_LE=ATT_LE_0 ATT_RSTn=ATT_RSTn_0 ATT_S_IN=ATT_S_IN_0 ATT_S_OUT=NetIC3A_19 RF_OUT=RF_OUT0 RFSW_CTRL=RFSW_CTRL0 VCO_OUT_N=VCO_OUT_N VCO_OUT_P=VCO_OUT_P
U_VCO_OUT_channel1: designators end in B; ports ATT_CLK=ATT_CLK_1 ATT_LE=ATT_LE_1 ATT_RSTn=ATT_RSTn_1 ATT_S_IN=ATT_S_IN_1 ATT_S_OUT=NetIC3B_19 RF_OUT=RF_OUT1 RFSW_CTRL=RFSW_CTRL1 VCO_OUT_N=VCO_OUT_N VCO_OUT_P=VCO_OUT_P
U_VCO_OUT_channel2: designators end in C; ports ATT_CLK=ATT_CLK_2 ATT_LE=ATT_LE_2 ATT_RSTn=ATT_RSTn_2 ATT_S_IN=ATT_S_IN_2 ATT_S_OUT=NetIC3C_19 RF_OUT=RF_OUT2 RFSW_CTRL=RFSW_CTRL2 VCO_OUT_N=VCO_OUT_N VCO_OUT_P=VCO_OUT_P
U_VCO_OUT_channel3: designators end in D; ports ATT_CLK=ATT_CLK_3 ATT_LE=ATT_LE_3 ATT_RSTn=ATT_RSTn_3 ATT_S_IN=ATT_S_IN_3 ATT_S_OUT=NetIC3D_19 RF_OUT=RF_OUT3 RFSW_CTRL=RFSW_CTRL3 VCO_OUT_N=VCO_OUT_N VCO_OUT_P=VCO_OUT_P

### Layout directives
net class 50_Ohms: NetC47A_1, NetC47A_2, NetC49A_1, NetC49A_2, NetC61A_1, NetC61A_2, NetC62A_1, NetC65A_1, NetC65A_2, NetC72A_1, NetC72A_2, NetFL1A_1, NetFL1A_3, NetR19A_2, NetR20A_2, NetR22A_2, NetR31A_2, NetR47A_1, RF_OUT0

### Notes on the sheet
- Jumpers R47/R49 and R48/C49 select between filter options
- Jumper
- (near IC3) Digital Attenuator
- F clk max = 30MHz
- +13dB @ 2GHz typ.
- Amplifier
- SPDT switch
- Copyright WUT 2017
  This documentation describes Open Hardware and is licensed under the CERN OHL v.1.1. You may redistribute and modify this documentation under the terms of the CERN OHL v.1.1. (http://ohwr.org/CERNOHL). This documentation is distributed WITHOUT ANY EXPRESS OR IMPLIED WARRANTY, INCLUDING OF MERCHANTABILITY, SATISFACTORY QUALITY AND FITNESS FOR A PARTICULAR PURPOSE. Please see the CERN OHL v.1.1 for applicable conditions.
- Project/Equipment
- Document
- Designer
- Drawn by
- Check.by
- File
- Last Mod.
- Print Date
- Sheet
- Size
- A3
- of
- Rev
- (in symbol FIL_MINI-CIRCUITS_LFCN-320) IN; OUT
- (in symbol HMC349ALP4CE) 50
- (in symbol HMC542BLP4E) 0.5dB; LE; 1dB; S_IN; S_OUT; 2dB; CONTROL INTERFACE; 4dB; CLK; 8dB; RST; 16dB
- (in symbol R0402_4K7_1%_0.0625W_100PPM) 1%
- (in symbol R0402_100R_1%_0.1W_100PPM) 1%
- (in symbol XFMR_MINI-CIRCUITS_TCM2-43X+) SEC; PRI

### Library data of the parts
C42 = CC0805_1UF_35V_20%_X7R: Non-polarised capacitor; Part Number: CC0805_2U2F_25V_20%_X7R; Part Description: SMD Multilayer Chip Ceramic Capacitor; Manufacturer: GENERIC; Manufacturer1 Part Number: TMK212B7225MG-TR; Voltage: 25V; TC: X7R; Tolerance: ±20%; Component Kind: Standard; Component Type: Standard; Pin Count: 2; Value: 2.2uF; Status: Not Recommended; Manufacturer Part Number: CC0805_2U2F_25V_20%_X7R; Case: 0805; Mounted: Yes; Socket: No; SMD: Yes; Sense: No; Manufacturer1 Example: TAIYO YUDEN; Manufacturer1 ComponentHeight: 1.35mm; HelpURL: \\cern.ch\dfs\Applications\Altium\Datasheets\CC0805_X7R_TAIYO-YUDEN_HIGH-VALUE.pdf; Author: CERN DEM JLC; CreateDate: 2011-06-22; LatestRevisionDate: 2011-06-22
C43 C53 C68 = CC0402_100NF_16V_10%_X7R: Non-polarised capacitor; Part Description: SMD Multilayer Chip Ceramic Capacitor; Manufacturer: GENERIC; Manufacturer1 Part Number: GRM155R71C104KA88D; Voltage: 16V; TC: X7R; Tolerance: ±10%; Part Number: CC0402_100NF_16V_10%_X7R; Component Kind: Standard; Component Type: Standard; Pin Count: 2; Value: 100nF; Status: Not Recommended; Manufacturer Part Number: CC0402_100NF_16V_10%_X7R; Case: 0402; Mounted: Yes; Socket: No; SMD: Yes; Sense: No; Manufacturer1 Example: MURATA; Manufacturer1 ComponentHeight: 0.55mm; HelpURL: \\cern.ch\dfs\Applications\Altium\Datasheets\CC0402_X7R_MURATA_GRM.pdf; Author: CERN DEM JLC; CreateDate: 2013-12-05; LatestRevisionDate: 2007-12-03
C45 C50 = CMP-1034-00013-1: CAP 0.5pF 10V ±0.1pF 0402 (1005 Metric) Thickness 0.6mm SMD; Case-Metric: 1005; Tolerance: Â±0.1pF; Case-EIA: 0402; Value: 0.5pF; Max Thickness: 0.6 mm; Rated Voltage: 10 V; Technology: SMT
C47 C49 C54-C62 C65 C72 = CC0402_10NF_16V_10%_X7R: as C22 on sheet VCO_channel; Part Number: CC0402_10NF_16V_10%_X7R; Component Kind: Standard; Component Type: Standard; Pin Count: 2; Value: 10nF; Status: Not Recommended; Manufacturer Part Number: CC0402_10NF_16V_10%_X7R; Case: 0402; Mounted: Yes; Socket: No; SMD: Yes; Sense: No; Manufacturer1 Example: PHYCOMP; Manufacturer1 ComponentHeight: 0.55mm; HelpURL: \\cern.ch\dfs\Applications\Altium\Datasheets\CC0402_X7R_PHYCOMP.pdf; Author: CERN DEM JLC; CreateDate: 2007-12-03; LatestRevisionDate: 2007-12-03
C51 C71 = CC0402_100PF_50V_5%_C0G: Non-polarised capacitor; Part Description: SMD Multilayer Chip Ceramic Capacitor; Manufacturer: GENERIC; Manufacturer1 Part Number: C0402C101J5GACTU; Voltage: 50V; TC: C0G/NP0; Tolerance: ±5%; Part Number: CC0402_100PF_50V_5%_C0G; Component Kind: Standard; Component Type: Standard; Pin Count: 2; Value: 100pF; Status: Preferred; Manufacturer Part Number: CC0402_100PF_50V_5%_C0G; Case: 0402; Mounted: Yes; Socket: No; SMD: Yes; Sense: No; Manufacturer1 Example: KEMET; Manufacturer1 ComponentHeight: 0.55mm; HelpURL: \\cern.ch\dfs\Applications\Altium\Datasheets\CC0805_C0G_KEMET_(Commercial Grade).pdf; Author: CERN DEM JLC; CreateDate: 2007-12-03; LatestRevisionDate: 2015-04-22
C52 C66 = CC0603_10UF_16V_20%_X5R: as C143 on sheet VCO_channel; Part Number: CC0603_10UF_16V_20%_X5R; Component Kind: Standard; Component Type: Standard; Pin Count: 2; Value: 10uF; Status: None; Manufacturer Part Number: CC0603_10UF_16V_20%_X5R; Case: 0603; Mounted: Yes; Socket: No; SMD: Yes; Sense: No; Manufacturer1 Example: MURATA; Manufacturer1 ComponentHeight: 0.8mm; HelpURL: \\cern.ch\dfs\Applications\Altium\Datasheets\CC0603_X5R_MURATA_GRM.pdf; Author: CERN DEM MR; CreateDate: 2016-03-02; LatestRevisionDate: 2016-03-02
C69 = CC0402_1NF_50V_10%_X7R: as C13 on sheet VCO_channel; Part Number: CC0402_1NF_50V_10%_X7R; Component Kind: Standard; Component Type: Standard; Pin Count: 2; Value: 1nF; Status: Not Recommended; Manufacturer Part Number: CC0402_1NF_50V_10%_X7R; Case: 0402; Mounted: Yes; Socket: No; SMD: Yes; Sense: No; Manufacturer1 Example: PHYCOMP; Manufacturer1 ComponentHeight: 0.55mm; HelpURL: \\cern.ch\dfs\Applications\Altium\Datasheets\CC0402_X7R_PHYCOMP.pdf; Author: CERN DEM JLC; CreateDate: 2007-12-03; LatestRevisionDate: 2007-12-03
FL1 = FIL_MINI-CIRCUITS_LFCN-320: 50 Ohm DC to 4400MHz Low Pass Filter; Part Number: FIL_MINI-CIRCUITS_LFCN-4400+; Part Description: 50 Ohm Low Pass Filter; Component Kind: Standard; Component Type: Standard; Pin Count: 2; Value: DC to 4400MHz; Status: None; Manufacturer: MINI-CIRCUITS; Mounted: Yes; Socket: No; SMD: Yes; Sense: No; ComponentHeight: 0.94mm; HelpURL: \\cern.ch\dfs\Applications\Altium\Datasheets\FIL_MINI-CIRCUITS_LFCN-4000+.pdf; Author: CERN DEM JLC; CreateDate: 2013-12-09; LatestRevisionDate: 2013-12-09
IC2 = ERA-4XSM+: DC-4GHz Monolithic Amplifier; Manufacturer: MINI-CIRCUITS; PressFit: No; Bonding: No; Part Number: ERA-4XSM+; Component Kind: Standard; Component Type: Standard; Device: ERA-4XSM+; PackageDescription: MINI-CIRCUITS WW107 Case, Body 2.16mm Diameter X 1.52mm H; Part Description: DC-4GHz Monolithic Amplifier; Manufacturer Part Number: ERA-4XSM+; Pin Count: 4; Mounted: Yes; Socket: No; SMD: Yes; Sense: No; ComponentHeight: 1.52mm; Author: CERN DEM JMW; HelpURL: \\cern.ch\dfs\Applications\Altium\Datasheets\ERA-4XSM+.pdf; CreateDate: 11.08.2016; LatestRevisionDate: 11.08.2016
IC3 = HMC542BLP4E: 0.5dB LSB GaAs MMIC 6-bit Digital Serial Control Attenuator, DC - 4GHz; Part Description: 0.5dB LSB GaAs MMIC 6-bit Digital Serial Control Attenuator, DC to 4GHz; Manufacturer: HITTITE MICROWAVE CORP; PressFit: No; Bonding: No; Part Number: HMC542BLP4E; Component Kind: Standard; Component Type: Standard; Device: HMC542BLP4E; PackageDescription: QFN, 0.50mm Pitch, Square; 24 Pin, 4.00mm L X 4.00mm W X 1.00mm H Body (w/thermal Tab 2.95 X 2.95mm), IPC Medium Density; Manufacturer Part Number: HMC542BLP4E; Pin Count: 25; Case: QFN24; Mounted: Yes; Socket: No; SMD: Yes; Sense: No; ComponentHeight: 1mm; Author: CERN DEM JMW; HelpURL: \\cern.ch\dfs\Applications\Altium\Datasheets\HMC542BLP4E.pdf; CreateDate: 2016-08-17; LatestRevisionDate: 2016-08-17
IC4 = HMC349ALP4CE: DC-4GHz High Isolation SPDT Non-Reflective Switch; Manufacturer: ANALOG DEVICES; PressFit: No; Bonding: No; Part Number: HMC349ALP4CE; Component Kind: Standard; Component Type: Standard; Device: HMC349ALP4CE; PackageDescription: QFN, 0.65mm pitch,square; 4 pin X 4 pin, 4mm X 4mm X 1mm H body (w/thermal tab 2.55 X 2.55mm),  IPC Medium Density; Part Description: DC-4GHz High Isolation SPDT Non-Reflective Switch; Manufacturer Part Number: HMC349ALP4CE; Pin Count: 17; Case: QFN16; Mounted: Yes; Socket: No; SMD: Yes; Sense: No; ComponentHeight: 1mm; Author: CERN DEM JLC; HelpURL: \\cern.ch\dfs\Applications\Altium\Datasheets\HMC349ALP4CE.pdf; CreateDate: 2017-02-23; LatestRevisionDate: 2017-02-23
L7 = IND_MINI-CIRCUITS_TCCH-80+: 50 Ohms, 50 to 8200 MHz RF Choke; Power: 200mA; Resistance: 0.1R; Part Number: IND_MINI-CIRCUITS_TCCH-80+; Component Kind: Standard; Component Type: Standard; Pin Count: 4; Value: 0.5uH@200mA; Status: None; Part Description: 50 Ohms, 50 to 8200 MHz RF Choke; Manufacturer: MINI-CIRCUITS; Mounted: Yes; Socket: No; SMD: Yes; Sense: No; ComponentHeight: 3.81mm; HelpURL: \\cern.ch\dfs\Applications\Altium\Datasheets\IND_MINI-CIRCUITS_TCCH-80+.pdf; Author: CERN DEM JLC; CreateDate: 2011-12-19; LatestRevisionDate: 2011-12-19
L8 L9 = IND0603_TDK_MPZ1608R391A: Inductor; Part Description: SMT Chip Bead for Power Line; Manufacturer: TDK; Power: 1.2A; Resistance: 0.12R; Tolerance: ±25%; Part Number: IND0603_TDK_MPZ1608R391A; Component Kind: Standard; Component Type: Standard; Pin Count: 2; Value: 390R@100MHz; Status: None; Manufacturer Part Number: MPZ1608R391A; Case: 0603; Mounted: Yes; Socket: No; SMD: Yes; Sense: No; ComponentHeight: 0.95mm; HelpURL: \\cern.ch\dfs\Applications\Altium\Datasheets\IND0603_TDK_MPZ1608.pdf; Author: CERN DEM JLC; CreateDate: 2009-12-02; LatestRevisionDate: 2009-12-02
R19 R20 R22 R31 R32 R34 R36-R42 R45 R47-R49 R51 R52 R54 = R0402_0R_JUMPER: Resistor; Part Description: 1A (0.05R Max DC Resistance) Zero Ohm Jumper; Manufacturer: GENERIC; Manufacturer1 Part Number: 232270591001L; Part Number: R0402_0R_JUMPER; Component Kind: Standard; Component Type: Standard; Pin Count: 2; Value: 0; Status: Not recommended; Manufacturer Part Number: R0402_0R_JUMPER; Case: 0402; Sense: No; Socket: No; SMD: Yes; Manufacturer1 Example: YAGEO PHYCOMP; Manufacturer1 ComponentHeight: 0.4mm; HelpURL: \\cern.ch\dfs\Applications\Altium\Datasheets\R0402_Phycomp_RC0402.pdf; Author: CERN DEM JLC; CreateDate: 2007-12-03; LatestRevisionDate: 2012-10-17
  R34 R36-R38 R47-R49 R51: Mounted: Yes
R46 = R1210_39R_1%_0.5W_100PPM: Resistor - 1%; Part Description: Thick Film Chip Resistor; Manufacturer: Panasonic; Manufacturer Part Number: ERJU14F39R0U; Power: 0.5W; TC: ±100ppm/°C; PressFit: No; Part Number: R1210_39R_1%_0.5W_100PPM; Component Kind: Standard; Component Type: Standard; Pin Count: 2; Value: 39R; Status: None; Case: 1210; Mounted: Yes; Sense: No; Socket: No; SMD: Yes; ComponentHeight: 0.7mm; HelpURL: \\cern.ch\dfs\Applications\Altium\Datasheets\R1210_VISHAY_CRCW1210.pdf; Author: GK; CreateDate: 06.08.2014; LatestRevisionDate: 06.08.2014
R56 R59 = R0402_4K7_1%_0.0625W_100PPM: as R15 on sheet VCO_channel; Part Number: R0402_4K7_1%_0.0625W_100PPM; Component Kind: Standard; Component Type: Standard; Pin Count: 2; Value: 4k7; Status: Not recommended; Power: 0.0625W; Tolerance: ±1%; Manufacturer Part Number: R0402_4K7_1%_0.0625W_100PPM; Case: 0402; Mounted: Yes; Sense: No; Socket: No; SMD: Yes; Manufacturer1 Example: YAGEO PHYCOMP; Manufacturer1 ComponentHeight: 0.4mm; HelpURL: \\cern.ch\dfs\Applications\Altium\Datasheets\R0402_Phycomp_RC0402.pdf; Author: CERN DEM JLC; CreateDate: 2007-12-03; LatestRevisionDate: 2012-10-17
R57 R58 = R0402_100R_1%_0.1W_100PPM: Resistor - 1%; Part Description: General Purpose Thick Film Chip Resistor; Manufacturer: GENERIC; Manufacturer Part Number: R0402_100R_1%_0.1W_100PPM_50V; Manufacturer1 Part Number: ERJ2RKF1000X; Power: 0.1W; TC: ±100ppm/°C; Voltage: 50V; Part Number: R0402_100R_1%_0.1W_100PPM; Component Kind: Standard; Component Type: Standard; Pin Count: 2; Value: 100; Status: Not recommended; Tolerance: ±1%; Case: 0402; Mounted: Yes; Sense: No; Socket: No; SMD: Yes; Manufacturer1 Example: PANASONIC; Manufacturer1 ComponentHeight: 0.4mm; HelpURL: \\cern.ch\dfs\Applications\Altium\Datasheets\R0402_PANASONIC_ERJ2RK.pdf; Author: CERN DEM JLC; CreateDate: 12.12.2013; LatestRevisionDate: 03.03.2015
TR1 = XFMR_MINI-CIRCUITS_TCM2-43X+: 50 OHMS 10 to 4000 MHz RF Transformer; Power: 0.4W; Part Number: XFMR_MINI-CIRCUITS_TCM2-43X+; Component Kind: Standard; Component Type: Standard; Pin Count: 6; Value: 1:2; Status: None; Part Description: 50 Ohms 10 to 4000MHz RF Transformer; Manufacturer: MINI-CIRCUITS; Mounted: Yes; Socket: No; Sense: No; SMD: Yes; ComponentHeight: 4.06mm; HelpURL: \\cern.ch\dfs\Applications\Altium\Datasheets\XFMR_MINI-CIRCUITS_TCM2-43X+.pdf; Author: CERN DEM BC; CreateDate: 2016-02-12; LatestRevisionDate: 2016-02-12